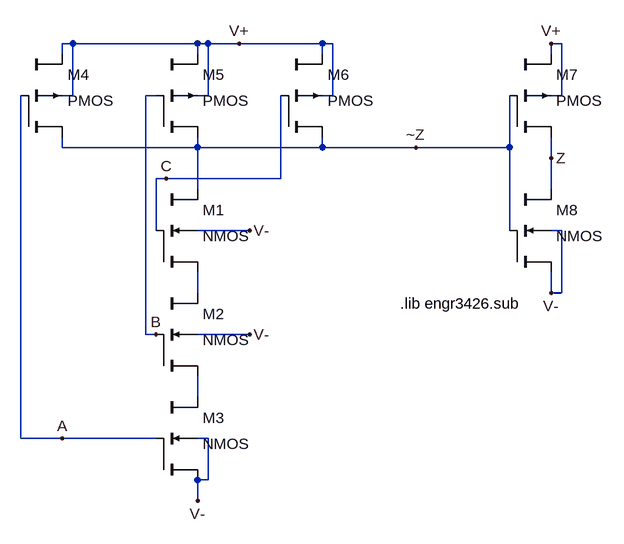
[diagram p0: schematic 3-N-AND.asc]
3-N-AND.asc, the LTspice schematic file:
Version 4
SHEET 1 880 680
WIRE -128 -96 -144 -96
WIRE 64 -96 -128 -96
WIRE 80 -96 64 -96
WIRE 128 -96 80 -96
WIRE 256 -96 128 -96
WIRE 272 -96 256 -96
WIRE 624 -96 608 -96
WIRE -144 -80 -144 -96
WIRE 64 -80 64 -96
WIRE 256 -80 256 -96
WIRE 608 -80 608 -96
WIRE -128 -16 -128 -96
WIRE -128 -16 -144 -16
WIRE 0 -16 -16 -16
WIRE 80 -16 80 -96
WIRE 80 -16 64 -16
WIRE 272 -16 272 -96
WIRE 272 -16 256 -16
WIRE 624 -16 624 -96
WIRE 624 -16 608 -16
WIRE -144 64 -144 48
WIRE 64 64 64 48
WIRE 64 64 -144 64
WIRE 256 64 256 48
WIRE 256 64 64 64
WIRE 400 64 256 64
WIRE 544 64 544 -16
WIRE 544 64 400 64
WIRE 608 80 608 48
WIRE 16 112 0 112
WIRE 192 112 192 -16
WIRE 192 112 16 112
WIRE 64 128 64 64
WIRE 608 128 608 80
WIRE 0 192 0 112
WIRE 144 192 64 192
WIRE 544 192 544 64
WIRE 624 192 608 192
WIRE 64 288 64 256
WIRE 608 288 608 256
WIRE 624 288 624 192
WIRE 624 288 608 288
WIRE -16 352 -16 -16
WIRE 0 352 -16 352
WIRE 144 352 64 352
WIRE 64 448 64 416
WIRE -208 512 -208 -16
WIRE -144 512 -208 512
WIRE 0 512 -144 512
WIRE 80 512 64 512
WIRE 80 576 80 512
WIRE 80 576 64 576
WIRE 64 608 64 576
FLAG -144 512 A
FLAG 0 352 B
FLAG 16 112 C
FLAG 128 -96 V+
FLAG 144 192 V-
FLAG 144 352 V-
FLAG 64 608 V-
FLAG 608 288 V-
FLAG 608 -96 V+
FLAG 400 64 ~Z
FLAG 608 80 Z
SYMBOL cktsym\\nmos4 64 192 R0
SYMATTR InstName M1
SYMATTR Value2 l=0.6um w=1.8um
SYMBOL cktsym\\nmos4 64 352 R0
SYMATTR InstName M2
SYMATTR Value2 l=0.6um w=1.8um
SYMBOL cktsym\\nmos4 64 512 R0
SYMATTR InstName M3
SYMATTR Value2 l=0.6um w=1.8um
SYMBOL cktsym\\pmos4 -144 -16 R0
SYMATTR InstName M4
SYMATTR Value2 l=0.6um w=1.8um
SYMBOL cktsym\\pmos4 64 -16 R0
SYMATTR InstName M5
SYMATTR Value2 l=0.6um w=1.8um
SYMBOL cktsym\\pmos4 256 -16 R0
SYMATTR InstName M6
SYMATTR Value2 l=0.6um w=1.8um
SYMBOL cktsym\\pmos4 608 -16 R0
SYMATTR InstName M7
SYMATTR Value2 l=0.6um w=1.8um
SYMBOL cktsym\\nmos4 608 192 R0
SYMATTR InstName M8
SYMATTR Value2 l=0.6um w=1.8um
TEXT 376 304 Left 2 !.lib engr3426.sub

The netlist it stands for:
* 3-N-AND.asc
M1 ~Z C N001 V- NMOS l=0.6um w=1.8um
M2 N001 B N002 V- NMOS l=0.6um w=1.8um
M3 N002 A V- V- NMOS l=0.6um w=1.8um
M4 ~Z A V+ V+ PMOS l=0.6um w=1.8um
M5 ~Z B V+ V+ PMOS l=0.6um w=1.8um
M6 ~Z C V+ V+ PMOS l=0.6um w=1.8um
M7 Z ~Z V+ V+ PMOS l=0.6um w=1.8um
M8 Z ~Z V- V- NMOS l=0.6um w=1.8um
.model NMOS NMOS
.model PMOS PMOS
.lib standard.mos
.lib engr3426.sub
.backanno
.end